# Altium schematic sheet DS135-1.0-A浊度传感器.SchDoc
size A4
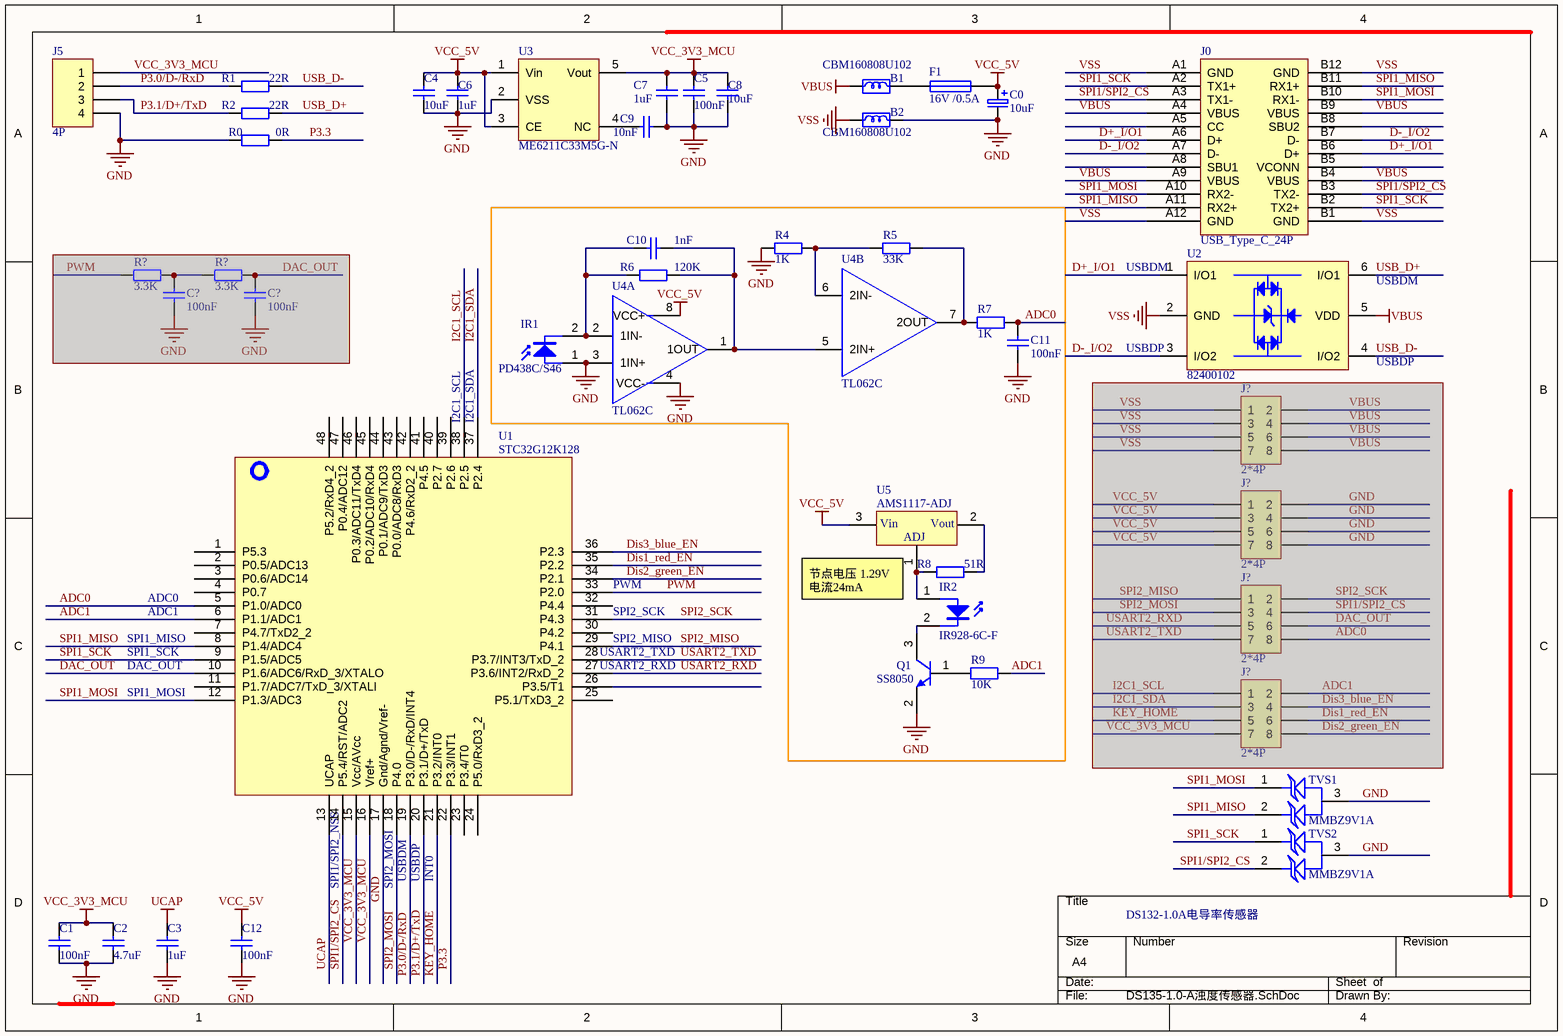
[diagram p0: DS135-1.0-A浊度传感器.SchDoc]

## Parts
(Parts that share a designator on the sheet are numbered #1, #2 ... from top to bottom, then left to right.)
B1  CBM160808U102  [0603Bead]
B2  CBM160808U102  [0603Bead]
C0  value 10uF  [AVX_3216-18(1206)_SMD]  (hidden comment: AVX_10uF/16V ±10％(C106))
C1  value 100nF  [0603CAP]  (hidden comment: SMDCAP00013)
C2  value 4.7uF  [0603CAP]  (hidden comment: SMDCAP00012)
C3  value 1uF  [0603CAP]  (hidden comment: SMDCAP00015)
C4  value 10uF  [1206CAP]  (hidden comment: MLCC 10uF 50V ±20％ 1206)
C5  value 100nF  [0603CAP]  (hidden comment: SMDCAP00013)
C6  value 1uF  [0603CAP]  (hidden comment: SMDCAP00015)
C7  value 1uF  [0603CAP]  (hidden comment: SMDCAP00015)
C8  value 10uF  [1206CAP]  (hidden comment: MLCC 10uF 50V ±20％ 1206)
C9  value 10nF  [0603CAP]  (hidden comment: SMDCAP00010)
C10  value 1nF  [0603CAP]  (hidden comment: SMDCAP00008)
C11  value 100nF  [0603CAP]  (hidden comment: SMDCAP00013)
C12  value 100nF  [0603CAP]  (hidden comment: SMDCAP00013)
C?#1  value 100nF  [0603CAP]  (hidden comment: SMDCAP00013)  (masked out: inside a compile mask, not in the netlist)
C?#2  value 100nF  [0603CAP]  (hidden comment: SMDCAP00013)  (masked out: inside a compile mask, not in the netlist)
F1  value 16V /0.5A  [1206FUSE]  (hidden comment: SMD1206-050C-16V)
IR1  PD438C/S46  [PD438C/S46]
IR2  IR928-6C-F  [IR928-6C-F]
J0  USB_Type_C_24P  [USB_TYPE_C_24P_Receptacle]
J5  value 4P  [H4]  (hidden comment: DIP4单排直针  间距2mm 针长11mm 铜)
J?#1  value 2*4P  [X1321FVS-2x04-C43D48]  (hidden comment: X1321FVS-2x04-C43D48)  (masked out: inside a compile mask, not in the netlist)
J?#2  value 2*4P  [X1321FVS-2x04-C43D48]  (hidden comment: X1321FVS-2x04-C43D48)  (masked out: inside a compile mask, not in the netlist)
J?#3  value 2*4P  [X1321FVS-2x04-C43D48]  (hidden comment: X1321FVS-2x04-C43D48)  (masked out: inside a compile mask, not in the netlist)
J?#4  value 2*4P  [X1321FVS-2x04-C43D48]  (hidden comment: X1321FVS-2x04-C43D48)  (masked out: inside a compile mask, not in the netlist)
Q1  value SS8050  [SOT23]  (hidden comment: SMDNPN00001)
R0  value 0R  [0603RES]  (hidden comment: Chip 0R 1/16W ±1％ 0603)
R1  value 22R  [0603RES]  (hidden comment: Chip 22R 1/16W ±1％ 0603)
R2  value 22R  [0603RES]  (hidden comment: Chip 22R 1/16W ±1％ 0603)
R4  value 1K  [0603RES]  (hidden comment: SMDRES00034)
R5  value 33K  [0603RES]  (hidden comment: SMDRES00034)
R6  value 120K  [0603RES]  (hidden comment: Chip 120K 1/16W ±1％ 0603)
R7  value 1K  [0603RES]  (hidden comment: SMDRES00034)
R8  value 51R  [0805RES]  (hidden comment: SMDRES00011)
R9  value 10K  [0603RES]  (hidden comment: SMDRES00056)
R?#1  value 3.3K  [0603RES]  (hidden comment: SMDRES00090)  (masked out: inside a compile mask, not in the netlist)
R?#2  value 3.3K  [0603RES]  (hidden comment: SMDRES00090)  (masked out: inside a compile mask, not in the netlist)
TVS1  MMBZ9V1A  [SOT23]
TVS2  MMBZ9V1A  [SOT23]
U1  value STC32G12K128  [LQFP-48]  (hidden comment: STC32G12K128_35I LQFP48)
U2  82400102  [SOT23-6]
U3  ME6211C33M5G-N  [SOT23-5]
U4  TL062C  [SO-8]  (parts A,B of 2)
U5  AMS1117-ADJ  [SOT223]

## Nets
GND: B2.2 C0.2 C1.1 C2.1 C3.1 C4.1 C5.1 C6.1 C7.1 C8.1 C9.2 C11.1 C12.1 IR1.1(K) J5.4 Q1.2(E) R0.1 R4.1 TVS1.3 TVS2.3 U1.17(Gnd/Agnd/Vref-) U3.2(VSS) U4.3(1IN+) U4.4(VCC-)
UCAP: C3.2 U1.13(UCAP)
VBUS: B1.1 J0.A4(VBUS) J0.A9(VBUS) J0.B4(VBUS) J0.B9(VBUS) U2.5(VDD)
VCC_3V3_MCU: C1.2 C2.2 C5.2 C7.2 C8.2 J5.1 U1.15(Vcc/AVcc) U1.16(Vref+) U3.5(Vout)
VCC_5V: C0.1 C4.2 C6.2 C12.2 F1.2 U3.1(Vin) U3.3(CE) U4.8(VCC+) U5.3(Vin)
VSS: B2.1 J0.A1(GND) J0.A12(GND) J0.B1(GND) J0.B12(GND) U2.2(GND)
ADC0: C11.2 R7.2 U1.5(P1.0/ADC0)
ADC1: R9.1 U1.6(P1.1/ADC1)
D+_I/O1: J0.A6(D+) J0.B6(D+) U2.1(I/O1)
D-_I/O2: J0.A7(D-) J0.B7(D-) U2.3(I/O2)
DAC_OUT: U1.10(P1.6/ADC6/RxD_3/XTALO)
Dis1_red_EN: U1.35(P2.2)
Dis2_green_EN: U1.34(P2.1)
Dis3_blue_EN: U1.36(P2.3)
I2C1_SCL: U1.38(P2.5)
I2C1_SDA: U1.37(P2.4)
KEY_HOME: U1.21(P3.2/INT0)
P3.0/D-/RxD: J5.2 R1.1 U1.19(P3.0/D-/RxD/INT4)
P3.1/D+/TxD: J5.3 R2.1 U1.20(P3.1/D+/TxD)
P3.3: R0.2 U1.22(P3.3/INT1)
PWM: U1.33(P2.0)
SPI1/SPI2_CS: J0.A3(TX1-) J0.B3(TX2-) TVS2.2 U1.14(P5.4/RST/ADC2)
SPI1_MISO: J0.A11(RX2+) J0.B11(RX1+) TVS1.2 U1.8(P1.4/ADC4)
SPI1_MOSI: J0.A10(RX2-) J0.B10(RX1-) TVS1.1 U1.12(P1.3/ADC3)
SPI1_SCK: J0.A2(TX1+) J0.B2(TX2+) TVS2.1 U1.9(P1.5/ADC5)
SPI2_MISO: U1.29(P4.1)
SPI2_MOSI: U1.18(P4.0)
SPI2_SCK: U1.31(P4.3)
USART2_RXD: U1.27(P3.6/INT2/RxD_2)
USART2_TXD: U1.28(P3.7/INT3/TxD_2)
USB_D+: R2.2 U2.6(I/O1)
USB_D-: R1.2 U2.4(I/O2)
NetB1_2: B1.2 F1.1
NetC9_1: C9.1 U3.4(NC)
NetC10_1: C10.1 IR1.2(A) R6.1 U4.2(1IN-)
NetC10_2: C10.2 R6.2 U4.1(1OUT) U4.5(2IN+)
NetIR2_1: IR2.1(K) R8.2 U5.1(ADJ)
NetIR2_2: IR2.2(A) Q1.3(C)
NetQ1_1: Q1.1(B) R9.2
NetR4_2: R4.2 R5.1 U4.6(2IN-)
NetR5_2: R5.2 R7.1 U4.7(2OUT)
NetR8_1: R8.1 U5.2(Vout)

Not connected (* = marked no-connect by the designer): J0 A5(CC) A8(SBU1) B5(VCONN) B8(SBU2); U1 1(P5.3) 2(P0.5/ADC13) 3(P0.6/ADC14) 4(P0.7) 7(P4.7/TxD2_2) 11(P1.7/ADC7/TxD_3/XTALI) 23(P3.4/T0) 24(P5.0/RxD3_2) 25(P5.1/TxD3_2) 26(P3.5/T1) 30(P4.2) 32(P4.4) 39(P2.6) 40(P2.7) 41(P4.5) 42(P4.6/RxD2_2) 43(P0.0/ADC8/RxD3) 44(P0.1/ADC9/TxD3) 45(P0.2/ADC10/RxD4) 46(P0.3/ADC11/TxD4) 47(P0.4/ADC12) 48(P5.2/RxD4_2)

## Notes on the sheet
- (near U2) USBDM
- (near U2) USBDP
- (near U1) I2C1_SCL
- (near U1) I2C1_SDA
- (near U1) SPI1_MISO
- SPI1_SCK
- ADC0
- ADC1
- (near U1) USART2_TXD
- (near U1) SPI2_MISO
- (near U1) SPI2_SCK
- (near U1) PWM
- (near U5) 节点电压 1.29V
  电流24mA
- (near U1) SPI1_MOSI
- DAC_OUT
- (near U1) USART2_RXD
- (near U1) SPI1/SPI2_NSS
- (near U1) SPI2_MOSI
- USBDM
- USBDP
- INT0
- DS132-1.0A电导率传感器
- DWG. NO.
- REV.
- SHT.
- THIS DOCUMENT AND THE DATA DISCLOSED HEREIN OR HEREWITH IS THE PROPERTY OF ALTIUM LIMITED AND MAY BE FREELY DISTRIBUTED IN WHOLE. NO RIGHTS ARE RESERVED OR EXPRESS OR IMPLIED WARANTEE GIVEN.
- REVISION
- DESCRIPTION
- DATE
- APPROVED
- ENG:
- APPROVALS
- PROJECT
- DSN:
- CHK:
- REFERENCE DOCUMENTS
- PROJECT REVISION:
- TITLE
- DOCUMENT REVISION:
- DESIGN ITEM:
- BOM:
- FAB DWG:
- PCB DWG:
- ASSY DWG:
- SCALE:
- SIZE
- B
- CAGE CODE
- FILE NAME
- DWG NO.
- SHEET
- OF
- REV

## Library data of the parts
B1 B2 = Chip Ferrite Bead 0606: 贴片磁珠
C0 = AVX_10uF/16V ±10％(C106): 钽电容
C1 C5 C11 C12 C?#1 C?#2 = MLCC 100nF 50V ±10％ 0603: 贴片电容
C2 = MLCC 4.7uF 50V ±10％ 0603: 贴片电容
C3 C6 C7 = MLCC 1uF 50V ±10％ 0603: 贴片电容
C4 C8 = MLCC 10uF 50V ±20％ 1206: 贴片电容
C9 = MLCC 10nF 50V ±10％ 0603: 贴片电容
C10 = MLCC 1nF 50V ±10％ 0603: 贴片电容
F1 = SMD1206-050C-16V: 贴片自恢复保险丝 16V /0.5A
J5 = DIP4单排直针  间距2mm 针长11mm 铜: 单排直针
J?#1-J?#4 = X1321FVS-2x04-C43D48: 双排母2x4P 立贴 1.27mm
Q1 = SS8050 Y1 SOT-23: 贴片三极管
R0 = Chip 0R 1/16W ±1％ 0603: 贴片电阻
R1 R2 = Chip 22R 1/16W ±1％ 0603: 贴片电阻
R4 R5 R7 = Chip 1K 1/16W ±1％ 0603: 贴片电阻
R6 = Chip 120K 1/16W ±1％ 0603: 贴片电阻
R8 = Chip 51R 1/10W ±1％ 0805: 贴片电阻
R9 = Chip 10K 1/16W ±1％ 0603: 贴片电阻
R?#1 R?#2 = Chip 3.3K 1/16W ±1％ 0603: 贴片电阻
TVS1 TVS2 = TVS: 瞬态抑制二极管
U1 = STC32G12K128_35I LQFP48: 单片机芯片
U2 = 82400102: 瞬态抑制二极管(TVS)
U3 = ME6211C33M5G-N: 稳压芯片
U5 = AMS1117-ADJ: 稳压芯片